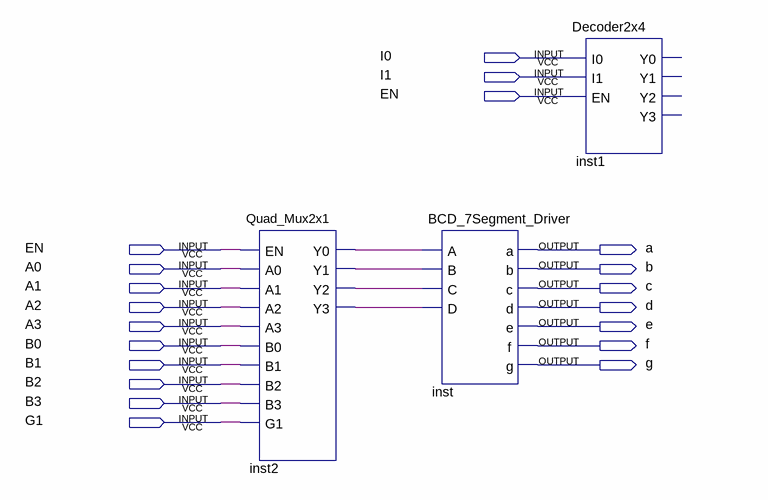
[diagram p0: schematic sheet]
// Quartus schematic ENCS234_Project_Quartus_Diagram.bdf as structural Verilog: 3 symbols, 20 pins
module ENCS234_Project_Quartus_Diagram (
  input  I0,
  input  I1,
  input  EN,
  input  A0,
  input  A1,
  input  A2,
  input  A3,
  input  B0,
  input  B1,
  input  B2,
  input  B3,
  input  G1,
  output a,
  output b,
  output c,
  output d,
  output e,
  output f,
  output g
);

  wire inst2_y0, inst2_y1, inst2_y2, inst2_y3;

  Quad_Mux2x1 inst2 (
    .EN(EN), .A0(A0), .A1(A1), .A2(A2), .A3(A3), .B0(B0), .B1(B1), .B2(B2), .B3(B3), .G1(G1), .Y0(inst2_y0),
    .Y1(inst2_y1), .Y2(inst2_y2), .Y3(inst2_y3));
  BCD_7Segment_Driver inst (
    .A(inst2_y0), .B(inst2_y1), .C(inst2_y2), .D(inst2_y3), .a(a), .b(b), .c(c), .d(d), .e(e), .f(f), .g(g));
  Decoder2x4 inst1 ();  // open: I0, I1, EN, Y0, Y1, Y2, Y3
endmodule
